# EAGLE schematic XICIE_AFE_SMD_revB (EAGLE 6.5.0)
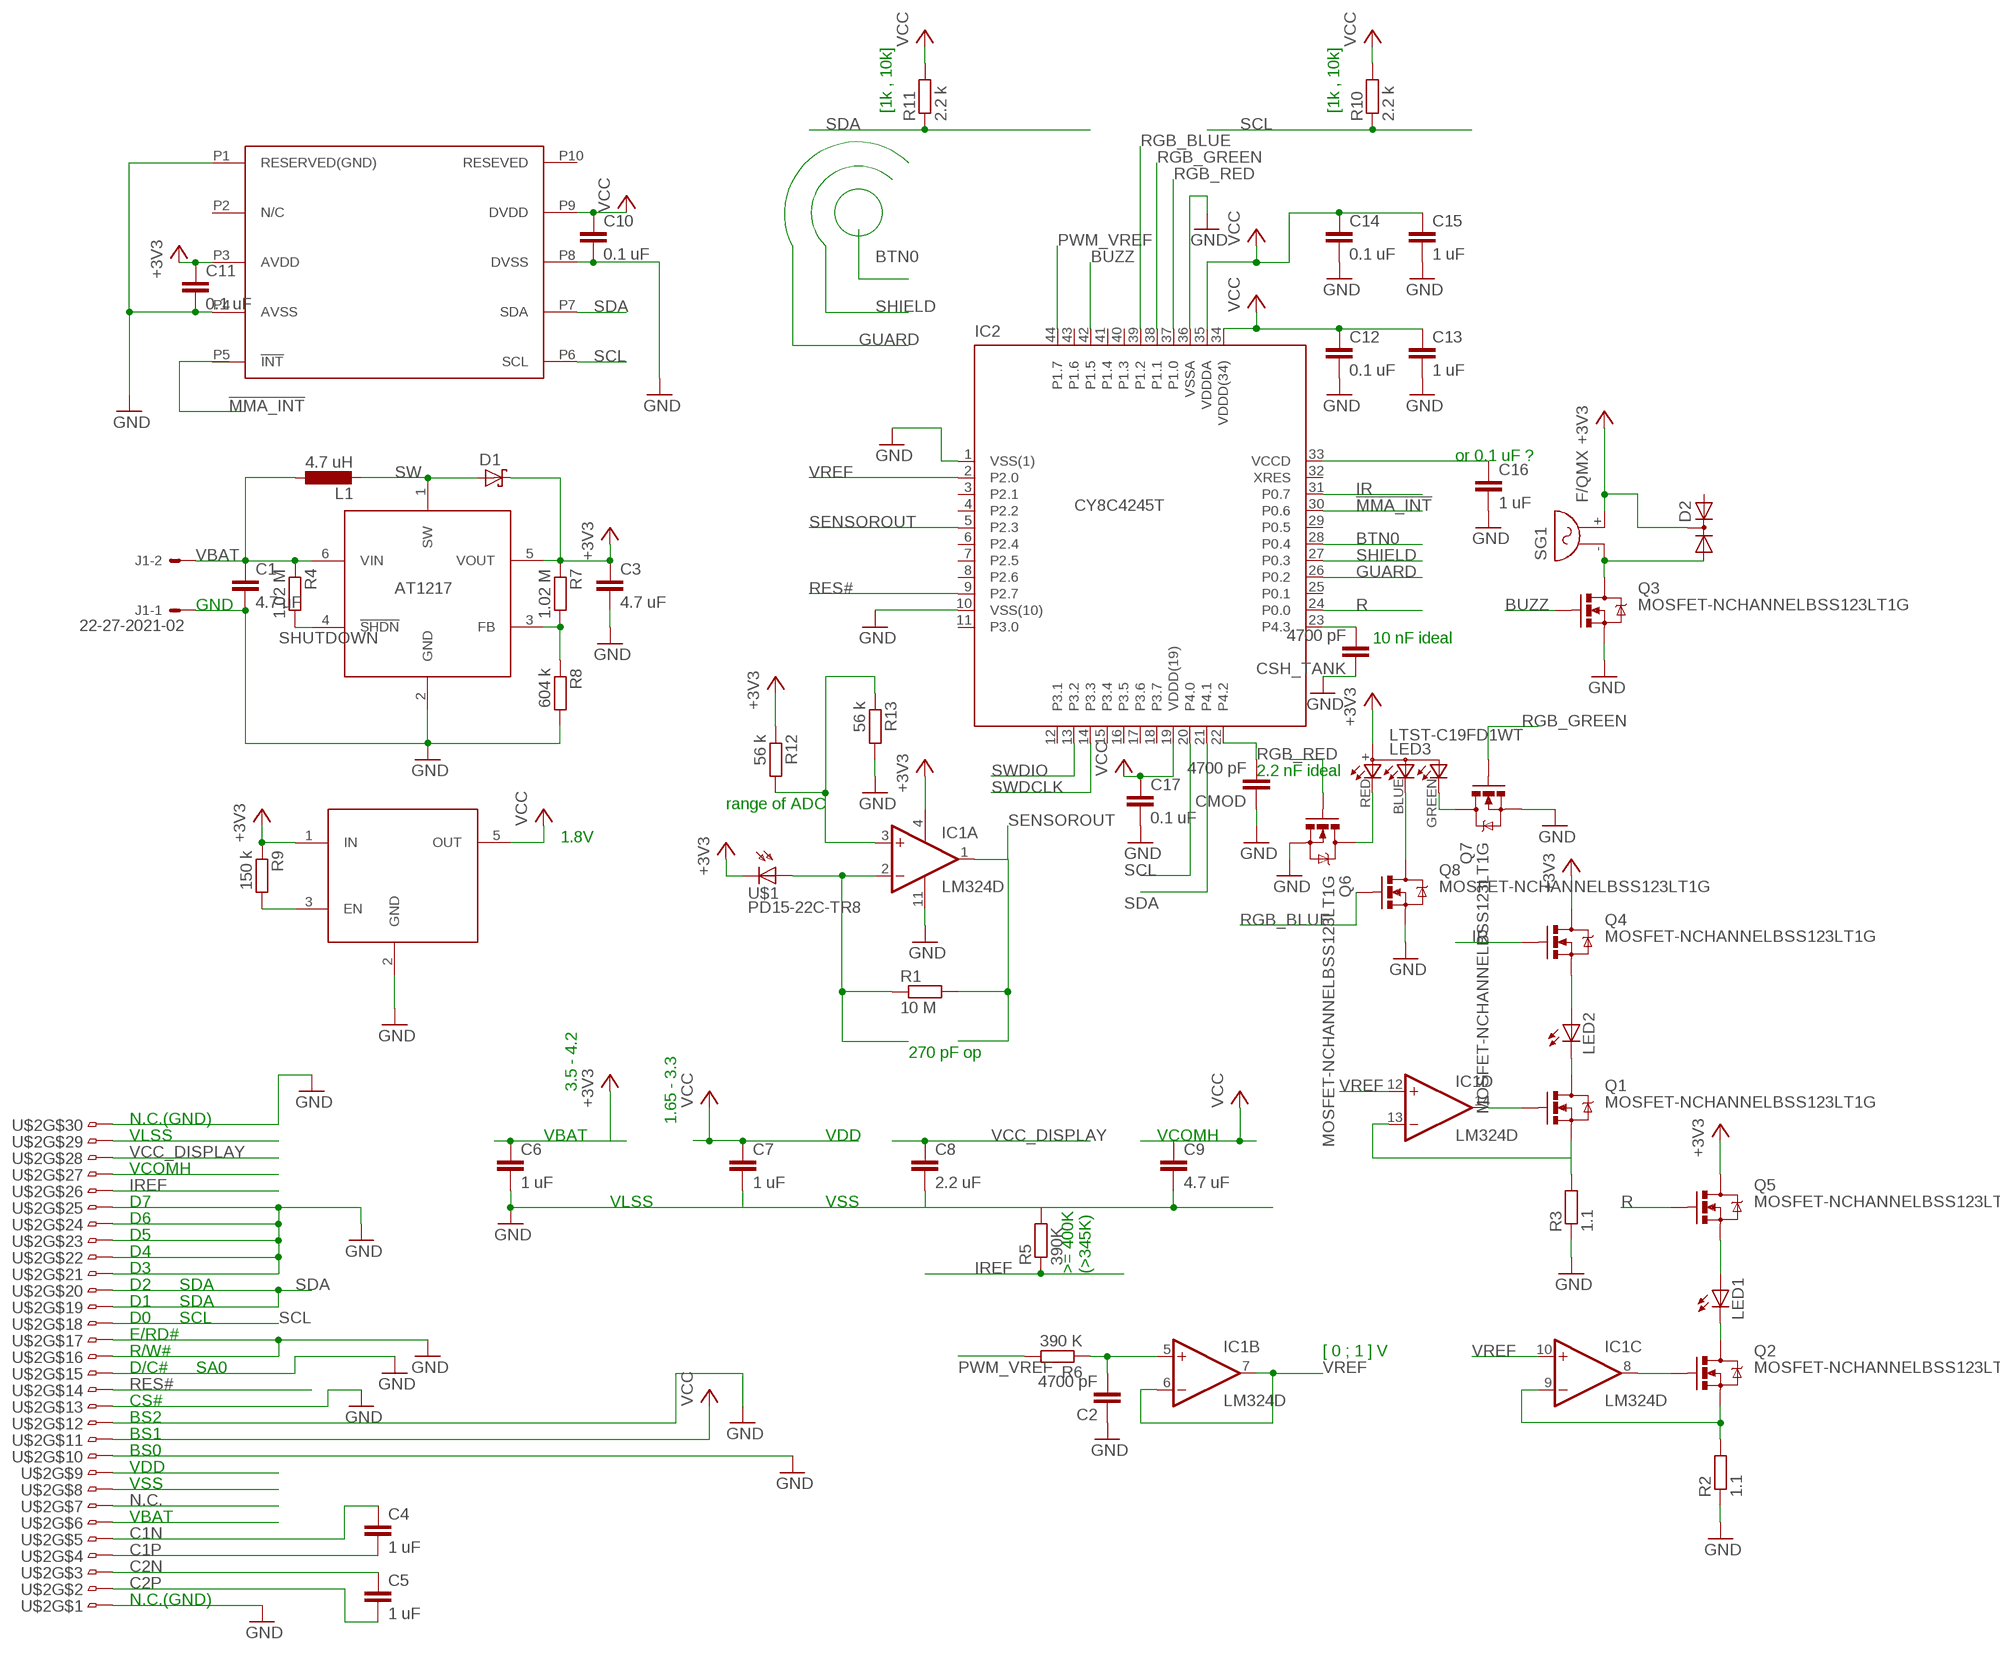
[diagram p0: schematic, sheet 1]

## Parts
C1  4.7 uF  C-EUC0603  [C0603]
C2  4700 pF  C-EUC0402  [C0402]
C3  4.7 uF  C-EUC0603  [C0603]
C4  1 uF  C-EUC0402  [C0402]
C5  1 uF  C-EUC0402  [C0402]
C6  1 uF  C-EUC0402  [C0402]
C7  1 uF  C-EUC0402  [C0402]
C8  2.2 uF  C-EUC0603  [C0603]
C9  4.7 uF  C-EUC0603  [C0603]
C10  0.1 uF  C-EUC0402  [C0402]
C11  0.1 uF  C-EUC0402  [C0402]
C12  0.1 uF  C-EUC0402  [C0402]
C13  1 uF  C-EUC0402  [C0402]
C14  0.1 uF  C-EUC0402  [C0402]
C15  1 uF  C-EUC0402  [C0402]
C16  1 uF  C-EUC0402  [C0402]
C17  0.1 uF  C-EUC0402  [C0402]
CMOD  4700 pF  C-EUC0402  [C0402]
CSH_TANK  4700 pF  C-EUC0402  [C0402]
D1  SCHOTTKY-DIODESMD  [SMINI2-F5-B]
D2  DIODE-2AC|CASOT23  [SOT23]
IC1  LM324D  [SO14]
IC2  CY8C4245T  [TQFP44]
IC3  AAT1217  [SOT23-6]
J1  22-27-2021-02  [6410-02]
L1  4.7 uH  L-EU  [L2518]
LED1  LED5MM  [LED5MM]
LED2  LED5MM  [LED5MM]
LED3  LTST-C19FD1WT  [GM1WA55311A]
Q1  MOSFET-NCHANNELBSS123LT1G  [SOT23]
Q2  MOSFET-NCHANNELBSS123LT1G  [SOT23]
Q3  MOSFET-NCHANNELBSS123LT1G  [SOT23]
Q4  MOSFET-NCHANNELBSS123LT1G  [SOT23]
Q5  MOSFET-NCHANNELBSS123LT1G  [SOT23]
Q6  MOSFET-NCHANNELBSS123LT1G  [SOT23]
Q7  MOSFET-NCHANNELBSS123LT1G  [SOT23]
Q8  MOSFET-NCHANNELBSS123LT1G  [SOT23]
R1  10 M  R-EU_R0402  [R0402]
R2  1.1  R-EU_R0402  [R0402]
R3  1.1  R-EU_R0402  [R0402]
R4  1.02 M  R-EU_R0805  [R0805]
R5  390K  R-EU_R0603  [R0603]
R6  390 K  R-EU_R0603  [R0603]
R7  1.02 M  R-EU_R0805  [R0805]
R8  604 k  R-EU_R0603  [R0603]
R9  150 k  R-EU_R0603  [R0603]
R10  2.2 k  R-EU_R0402  [R0402]
R11  2.2 k  R-EU_R0402  [R0402]
R12  56 k  R-EU_R0603  [R0603]
R13  56 k  R-EU_R0603  [R0603]
SG1  F/QMX  [F/QMX]
U$1  PD15-22C-TR8  [PHOTO_SMD]
U$2  ER-OLED0.96  [FLEX0.7X30]
U$3  AAT3221  [SOT23-5]
U$4  MMA7660FC  [DFN10]

## Nets
!MMA_INT: IC2.30(P0.6)
+3V3 [V]: C3.1 C6.1 C11.1 D1.C D2.3(C) IC1.4(P:V+) IC3.5(VOUT) LED3.+(A) Q4.3(D) Q5.3(D) R7.1 R9.1 R12.1 SG1.+ U$1.CATHODE1(C) U$1.CATHODE2(C) U$2.P6 U$3.1(IN) U$4.P3(AVDD)
BTN0: IC2.28(P0.4)
BUZZ: IC2.42(P1.5) Q3.1(G)
C1N: C4.1 U$2.P5
C1P: C4.2 U$2.P4
C2N: C5.1 U$2.P3
C2P: C5.2 U$2.P2
GND [GND]: C1.2 C2.1 C3.2 C6.2 C7.2 C8.2 C9.2 C10.2 C11.2 C12.2 C13.2 C14.2 C15.2 C16.2 C17.2 CMOD.1 CSH_TANK.1 IC1.11(P:V-) IC2.1(VSS(1)) IC2.10(VSS(10)) IC2.36(VSSA) IC3.2(GND) J1.1 Q3.2(S) Q6.2(S) Q7.2(S) Q8.2(S) R2.1 R3.1 R5.2 R8.2 R13.2 U$2.P1 U$2.P8 U$2.P10 U$2.P12 U$2.P13 U$2.P15 U$2.P16 U$2.P17 U$2.P21 U$2.P22 U$2.P23 U$2.P24 U$2.P25 U$2.P29 U$2.P30 U$3.2(GND) U$4.P1(RESERVED(GND)) U$4.P4(AVSS) U$4.P8(DVSS)
GUARD: IC2.26(P0.2)
IR: IC2.31(P0.7) Q4.1(G)
IREF: R5.1 U$2.P26
N$1: IC1.2(A:-IN) R1.1 U$1.ANODE1(A) U$1.ANODE2(A)
N$3: IC1.9(C:-IN) Q2.2(S) R2.2
N$4: LED2.A Q4.2(S)
N$5: LED1.K(C) Q2.3(D)
N$6: LED2.K(C) Q1.3(D)
N$7: IC1.8(C:OUT) Q2.1(G)
N$8: IC1.13(D:-IN) Q1.2(S) R3.2
N$9: C2.2 IC1.5(B:+IN) R6.1
N$10 [V]: C16.1 IC2.33(VCCD)
N$12: IC3.3(FB) R7.2 R8.1
N$13: D2.1(A1) Q3.3(D) SG1.-
N$14: R9.2 U$3.3(EN)
N$15: IC1.3(A:+IN) R12.2 R13.1
N$16: LED1.A Q5.2(S)
N$17: LED3.RED(CRED) Q6.3(D)
N$18: LED3.BLUE(CBLUE) Q8.3(D)
N$19: IC1.14(D:OUT) Q1.1(G)
N$20: LED3.GREEN(CGREEN) Q7.3(D)
N$21: CMOD.2 IC2.22(P4.2)
N$22: CSH_TANK.2 IC2.23(P4.3)
N.C.: U$2.P7
PWM_VREF: IC2.44(P1.7) R6.2
R: IC2.24(P0.0) Q5.1(G)
RES#: IC2.9(P2.7) U$2.P14
RGB_BLUE: IC2.39(P1.2) Q8.1(G)
RGB_GREEN: IC2.38(P1.1) Q7.1(G)
RGB_RED: IC2.37(P1.0) Q6.1(G)
SCL: IC2.20(P4.0) R10.1 U$2.P18 U$4.P6(SCL)
SDA: IC2.21(P4.1) R11.1 U$2.P19 U$2.P20 U$4.P7(SDA)
SENSOROUT: IC1.1(A:OUT) IC2.5(P2.3) R1.2
SHIELD: IC2.27(P0.3)
SHUTDOWN: IC3.4(!SHDN) R4.2
SW: D1.A IC3.1(SW) L1.2
SWDCLK: IC2.14(P3.3)
SWDIO: IC2.13(P3.2)
VBAT [V]: C1.1 IC3.6(VIN) J1.2 L1.1 R4.1
VCC [V]: C7.1 C9.1 C10.1 C12.1 C13.1 C14.1 C15.1 C17.1 IC2.19(VDDD(19)) IC2.34(VDDD(34)) IC2.35(VDDDA) R10.2 R11.2 U$2.P9 U$2.P11 U$2.P27 U$3.5(OUT) U$4.P9(DVDD)
VCC_DISPLAY [V]: C8.1 U$2.P28
VREF: IC1.6(B:-IN) IC1.7(B:OUT) IC1.10(C:+IN) IC1.12(D:+IN) IC2.2(P2.0)
Unconnected: D2.2(A2) IC2.3(P2.1) IC2.6(P2.4) IC2.7(P2.5) IC2.11(P3.0) IC2.12(P3.1) IC2.15(P3.4) IC2.16(P3.5) IC2.18(P3.7) IC2.25(P0.1) IC2.29(P0.5) IC2.32(XRES) IC2.40(P1.3) IC2.41(P1.4) IC2.43(P1.6) U$4.P2(N/C) U$4.P5(!INT) U$4.P10(RESEVED)

## Notes on the sheet
- [1k , 10k] | [1k , 10k]
- or 0.1 uF ?
- GND
- 10 nF ideal
- 2.2 nF ideal
- range of ADC
- 1.8V
- 270 pF op
- 3.5 - 4.2
- N.C.(GND) | 1.65 - 3.3
- VLSS | VBAT | VDD | VCOMH
- VCOMH
- D7 | VLSS | VSS
- D6
- D5
- D4
- D3
- >= 400K
  (>345K)
- D2 | SDA
- D1 | SDA
- D0 | SCL
- E/RD#
- R/W# | [ 0 ; 1 ] V
- D/C# | SA0
- CS#
- BS2
- BS1
- BS0
- VDD
- VSS
- VBAT
- N.C.(GND)

## Power pins joined to a net without a drawn wire
P2.2: IC2.4(P2.2)
P2.6: IC2.8(P2.6)
P3.6: IC2.17(P3.6)

## Library data of the parts
C1-C17 CMOD CSH_TANK = rcl:C-EU: CAPACITOR, European symbol
D1 = juliano:SCHOTTKY-DIODE: Schottky Diode
D2 = diode:DIODE-2AC|CA: Dual DIODE Anode-Cathode|Cathode-Anode
IC1 = linear:LM324: OP AMP
IC2 = juliano:CY8C4245: PSoC® Programmable System-on-Chip TM M8C Processor Speeds up to 24 MHz Source: http://www.cypress.com .. CY8C4245AXI-483; OC_FARNELL: unknown; OC_NEWARK: unknown
IC3 = juliano:AAT1217
J1 = con-molex:22-?-02: CONNECTOR wire to board 2.54 mm (.1 inch) pitch header; OC_FARNELL: unknown; OC_NEWARK: unknown
L1 = juliano:L-EU: INDUCTOR, European symbol
LED1 LED2 = led:LED: LED OSRAM: - CHIPLED LG R971, LG N971, LY N971, LG Q971, LY Q971, LO R971, LY R971 LH N974, LH R974 LS Q976, LO Q976, LY Q976 LO Q996 - Hyper CHIPLED LW Q18S LB Q993, LB Q99A, LB R99A - SideLED LS A670, LO A670, LY A670, LG A670, LP A670 LB A673, LV A673, LT A673, LW A673 LH A674 LY A675 LS A676, LA A676, LO A676, LY A676, LW A676 LS A679, LY A679, LG A679 - Hyper Micro SIDELED® LS Y876, LA Y876, LO Y876, LY Y876 LT Y87S - SmartLED LW L88C, LW L88S LB L89C, LB L89S, LG L890 LS L89K, LO L89K, LY L89K LS L896, LA L896, LO L896, LY L896 - TOPLED LS T670, LO T670, LY T670, LG T670, LP T670 LSG T670, LSP T670, LSY T670, LOP T670, LYG T670 LG T671, LOG T671, LSG T671 LB T673, LV T673, LT T673, LW T673 LH T674 LS T676, LA T676, LO T676, LY T676, LB T676, LH T676, LSB T676, LW T676 LB T67C, LV T67C, LT T67C, LS T67K, LO T67K, LY T67K, LW E67C LS E67B, LA E67B, LO E67B, LY E67B, LB E67C, LV E67C, LT E67C LW T67C LS T679, LY T679, LG T679 LS T770, LO T770, LY T770, LG T770, LP T770 LB T773, LV T773, LT T773, LW T773 LH T774 LS E675, LA E675, LY E675, LS T675 LS T776, LA T776, LO T776, LY T776, LB T776 LHGB T686 LT T68C, LB T68C - Hyper Mini TOPLED® LB M676 - Mini TOPLED Santana® LG M470 LS M47K, LO M47K, LY M47K Source: http://www.osram.convergy.de LUXEON: - LUMILED® LXK2-PW12-R00, LXK2-PW12-S00, LXK2-PW14-U00, LXK2-PW14-V00 LXK2-PM12-R00, LXK2-PM12-S00, LXK2-PM14-U00 LXK2-PE12-Q00, LXK2-PE12-R00, LXK2-PE12-S00, LXK2-PE14-T00, LXK2-PE14-U00 LXK2-PB12-K00, LXK2-PB12-L00, LXK2-PB12-M00, LXK2-PB14-N00, LXK2-PB14-P00, LXK2-PB14-Q00 LXK2-PR12-L00, LXK2-PR12-M00, LXK2-PR14-Q00, LXK2-PR14-R00 LXK2-PD12-Q00, LXK2-PD12-R00, LXK2-PD12-S00 LXK2-PH12-R00, LXK2-PH12-S00 LXK2-PL12-P00, LXK2-PL12-Q00, LXK2-PL12-R00 Source: www.luxeon.com KINGBRIGHT: KA-3528ASYC Source: www.kingbright.com
LED3 = juliano:LTST-C19FD1WT: Chip LED RGB Source: http://optoelectronics.liteon.com/upload/download/DS22-2001-076/S_110_LTST-C19FD1WT.pdf
Q1-Q8 = SparkFun-DiscreteSemi:MOSFET-NCHANNEL: Common NMOSFET Parts MFG P/N Store ID Prod ID FDD8780 TRANS-09984 SI7820DN TRANS-11055 FDS6630A IC-08089 2N7002PW TRANS-11151 FQP30N06L COM-10213 TRANS-10060 BSS123LT1G TRANS-08345 BSS138 TRANS-00830 BS170 2N7000; PROD_ID: TRANS-08345
R1-R4 R6-R13 = rcl:R-EU_: RESISTOR, European symbol
R5 = resistor:R-EU_: RESISTOR, European symbol
SG1 = buzzer:F/QMX: BUZZER Source: Buerklin; OC_FARNELL: unknown; OC_NEWARK: unknown
U$1 = juliano:PD15-22C-TR8
U$2 = juliano:ER-OLED0.96
U$3 = juliano:AAT3221
U$4 = juliano:MMA7660FC